# Altium project PowerBoard_v1.PrjPCB
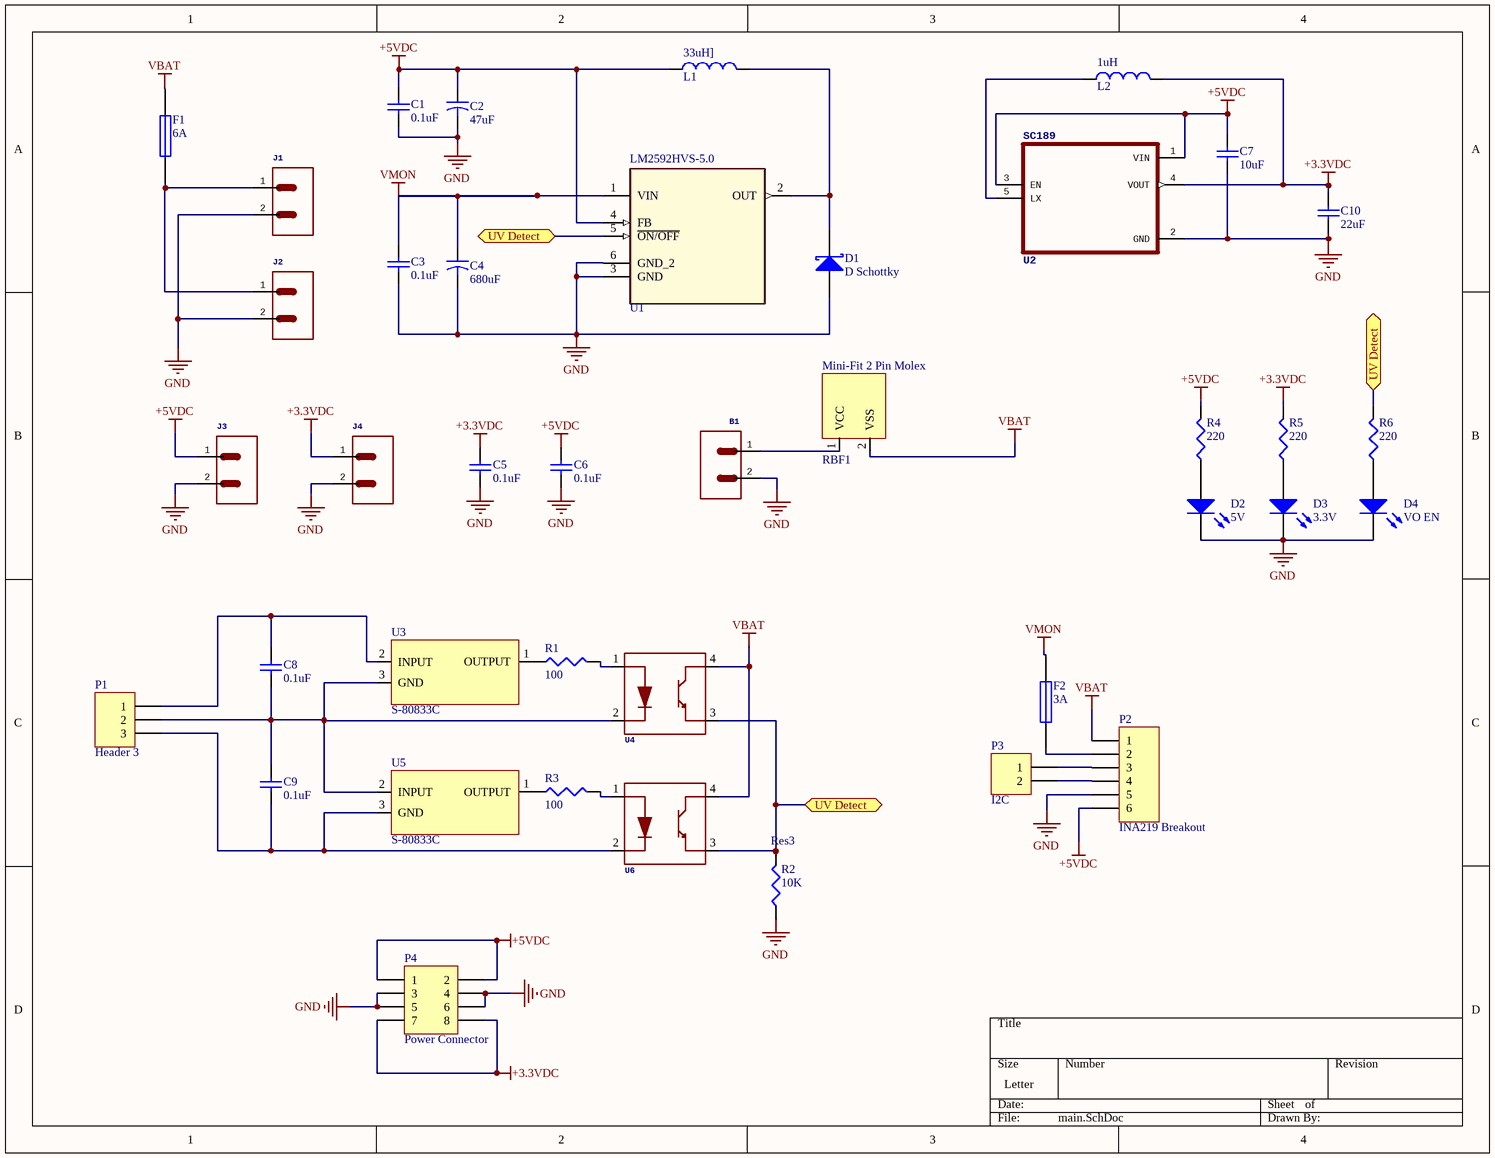
[diagram p0: main.SchDoc]
1 sheet, 40 parts. Net scope: flat (ports and power ports of the same name join across sheets).
Board file: PowerPCB.PcbDoc

## Sheet main.SchDoc
size Letter

### Parts
B1  15A 2P TERM BLOCK, BLACKtested: NO  [Mini-Fit 2 Pin Molex]  (value not drawn)
C1  value 0.1uF  [C1206]  (hidden comment: Cap Semi)
C2  value 47uF  [47 uF Cap]  (hidden comment: Cap2)
C3  value 0.1uF  [C1206]  (hidden comment: Cap Semi)
C4  value 680uF  [680 uF Cap]  (hidden comment: Cap2)
C5  value 0.1uF  [C1206]  (hidden comment: Cap Semi)
C6  value 0.1uF  [C1206]  (hidden comment: Cap Semi)
C7  value 10uF  [C1206]  (hidden comment: Cap Semi)
C8  value 0.1uF  [C1206]  (hidden comment: Cap Semi)
C9  value 0.1uF  [C1206]  (hidden comment: Cap Semi)
C10  value 22uF  [C1206]  (hidden comment: Cap Semi)
D1  D Schottky  [SMB]
D2  5V  [1608[0603]]
D3  3.3V  [1608[0603]]
D4  VO EN  [1608[0603]]
F1  6A  [C1206]
F2  3A  [J1-0603]
J1  15A 2P TERM BLOCK, BLACKtested: NO  [1760490000]  (value not drawn)
J2  15A 2P TERM BLOCK, BLACKtested: NO  [1760490000]  (value not drawn)
J3  15A 2P TERM BLOCK, BLACKtested: NO  [1760490000]  (value not drawn)
J4  15A 2P TERM BLOCK, BLACKtested: NO  [1760490000]  (value not drawn)
L1  33uH]  [Inductor]
L2  1uH  [INDC4532X34N]
P1  Header 3  [HDR1X3]
P2  INA219 Breakout  [HDR1X6]
P3  I2C  [HDR1X2]
P4  Power Connector  [HDR2X4]
R1  value 100  [J1-0603]  (hidden comment: Res3)
R2  Res3  value 10K  [J1-0603]
R3  value 100  [J1-0603]  (hidden comment: Res3)
R4  value 220  [J1-0603]  (hidden comment: Res3)
R5  value 220  [J1-0603]  (hidden comment: Res3)
R6  value 220  [J1-0603]  (hidden comment: Res3)
RBF1  Mini-Fit 2 Pin Molex  [Mini-Fit 2 Pin Molex]
U1  LM2592HVS-5.0  [*TO170P1435X457-5N]
U2  SC189  [SOT95P280X145-5N]
U3  S-80833C  [TO-92A]
U4  306060007  [SOP-4]  (value not drawn)
U5  S-80833C  [TO-92A]
U6  306060007  [SOP-4]  (value not drawn)

### Ports
UV Detect (bidir)

### Nets
+3.3VDC: C5.2 C10.2 J4.1 L2.1 P4.7 P4.8 R5.2 U2.4(VOUT)
+5VDC: C1.2 C2.1 C6.2 C7.2 J3.1 L1.2 P2.6 P4.1 P4.2 R4.2 U1.4(FB) U2.1(VIN) U2.3(EN)
GND: B1.2 C1.1 C2.2 C3.1 C4.2 C5.1 C6.1 C7.1 C10.1 D1.1(A) D2.2(K) D3.2(K) D4.2(K) J1.2 J2.2 J3.2 J4.2 P2.5 P4.3 P4.4 P4.5 P4.6 R2.1 U1.3(GND) U1.6(GND_2) U2.2(GND)
VBAT: F1.2 P2.1 RBF1.2(VSS) U4.4(C) U6.4(C)
VMON: C3.2 C4.1 F2.2 U1.1(VIN)
NetB1_1: B1.1 RBF1.1(VCC)
NetC8_1: C8.1 C9.2 P1.2 U3.3(GND) U4.2(CA) U5.2(INPUT)
NetC8_2: C8.2 P1.1 U3.2(INPUT)
NetC9_1: C9.1 P1.3 U5.3(GND) U6.2(CA)
NetD1_2: D1.2(K) L1.1 U1.2(OUT)
NetD2_1: D2.1(A) R4.1
NetD3_1: D3.1(A) R5.1
NetD4_1: D4.1(A) R6.1
NetF1_1: F1.1 J1.1 J2.1
NetF2_1: F2.1 P2.2
NetL2_2: L2.2 U2.5(LX)
NetP2_3: P2.3 P3.1
NetP2_4: P2.4 P3.2
NetR1_1: R1.1 U3.1(OUTPUT)
NetR1_2: R1.2 U4.1(AN)
NetR2_2: R2.2 R6.2 U1.5(~{ON/OFF}) U4.3(E) U6.3(E) ; port UV Detect
NetR3_1: R3.1 U5.1(OUTPUT)
NetR3_2: R3.2 U6.1(AN)

### Library data of the parts
B1 J1-J4 = 1760510000: GateName_1: G$1; SymbolName_1: CONN2; LibraryName: PowerBoardLib1; DeviceSetName: 1760510000; Package: 1760490000
C1 C3 C5-C10 = Cap Semi: Capacitor (Semiconductor SIM Model); Published: 8-Jun-2000; LatestRevisionDate: 29-May-2009; LatestRevisionNote: IPC-7351 Footprint Added.; PackageReference: C1206; Publisher: Altium Limited; PackageDescription: Chip Capacitor
C2 C4 = Cap2: Capacitor; Published: 23-Sep-2002; PackageReference: CAPR5-4X5; Publisher: Altium Limited; PackageDescription: Capacitor; 2 Leads
D1 = D Schottky: Schottky Diode; Published: 8-Jun-2000; LatestRevisionDate: 17-Jul-2002; LatestRevisionNote: Re-released for DXP Platform.; PackageReference: SMB; Publisher: Altium Limited; PackageDescription: DO-214-AA/SMB; 2 C-Bend Leads; Body 5.3 x 3.6 mm, inc. leads (LxW); Code_JEDEC: DO-214-AA
D2-D4 = LED1: Typical RED GaAs LED; Published: 8-Jun-2000; LatestRevisionDate: 08-Jul-2005; LatestRevisionNote: Mech Layer 1 removed.; PackageReference: LED-1; Publisher: Altium Limited; PackageDescription: LED; 2 Leads
F1 F2 = Fuse 1: Fuse; Published: 8-Jun-2000; LatestRevisionDate: 17-Jul-2002; LatestRevisionNote: Re-released for DXP Platform.; PackageReference: PIN-W2/E2.8; Publisher: Altium Limited; PackageDescription: Thru-Hole; 2 Leads
L1 L2 = Inductor
P1 = Header 3: Header, 3-Pin; LatestRevisionDate: 17-Jul-2002; LatestRevisionNote: Re-released for DXP Platform.; Publisher: Altium Limited
P2 = Header 6: Header, 6-Pin; LatestRevisionDate: 17-Jul-2002; LatestRevisionNote: Re-released for DXP Platform.; Publisher: Altium Limited
P3 = Header 2: Header, 2-Pin; LatestRevisionDate: 17-Jul-2002; LatestRevisionNote: Re-released for DXP Platform.; Publisher: Altium Limited
P4 = Header 4X2: Header, 4-Pin, Dual row; LatestRevisionDate: 17-Jul-2002; LatestRevisionNote: Re-released for DXP Platform.; Publisher: Altium Limited
R1-R6 = Res3: Resistor; Published: 8-Jun-2000; LatestRevisionDate: 29-May-2009; LatestRevisionNote: IPC-7351 Footprint Added.; PackageReference: J1-0603; Publisher: Altium Limited; PackageDescription: Chip Resistor
RBF1 = 5557 5569 Mini-Fit 2 Pin Molex
U2 = SC189ZSKTRT_1: Manufacturer: Semtech Corporation; GateName_1: G$1; SymbolName_1: SC189ZSKTRT; LibraryName: PowerBoardLib1; DeviceSetName: SC189ZSKTRT; Package: SOT95P280X145-5N
U4 U6 = SMD-PHOTOCOUPLER-5KV-LTV-816S(4P-4.6X6.5MM): GateName_1: G$1; SymbolName_1: PHOTOCOUPLER-LTV-816S; LibraryName: PowerBoardLib1; DeviceSetName: SMD-PHOTOCOUPLER-5KV-LTV-816S(4P-4.6X6.5MM); Package: SMD4-2.54-4.6X6.5MM; MPN: LTV-816S
U1 = LM2592HVS-5.0: Value: *